# Altium schematic sheet 3_mcu_radio_0.schdoc: MCU Radio 0
size A3; DrawnBy: Sara Vega Martinez; Revision: v0.1; SheetNumber: 3; SheetTotal: 6; DesignedBy: André M. P. Mattos; ProjectRevision: v0.1
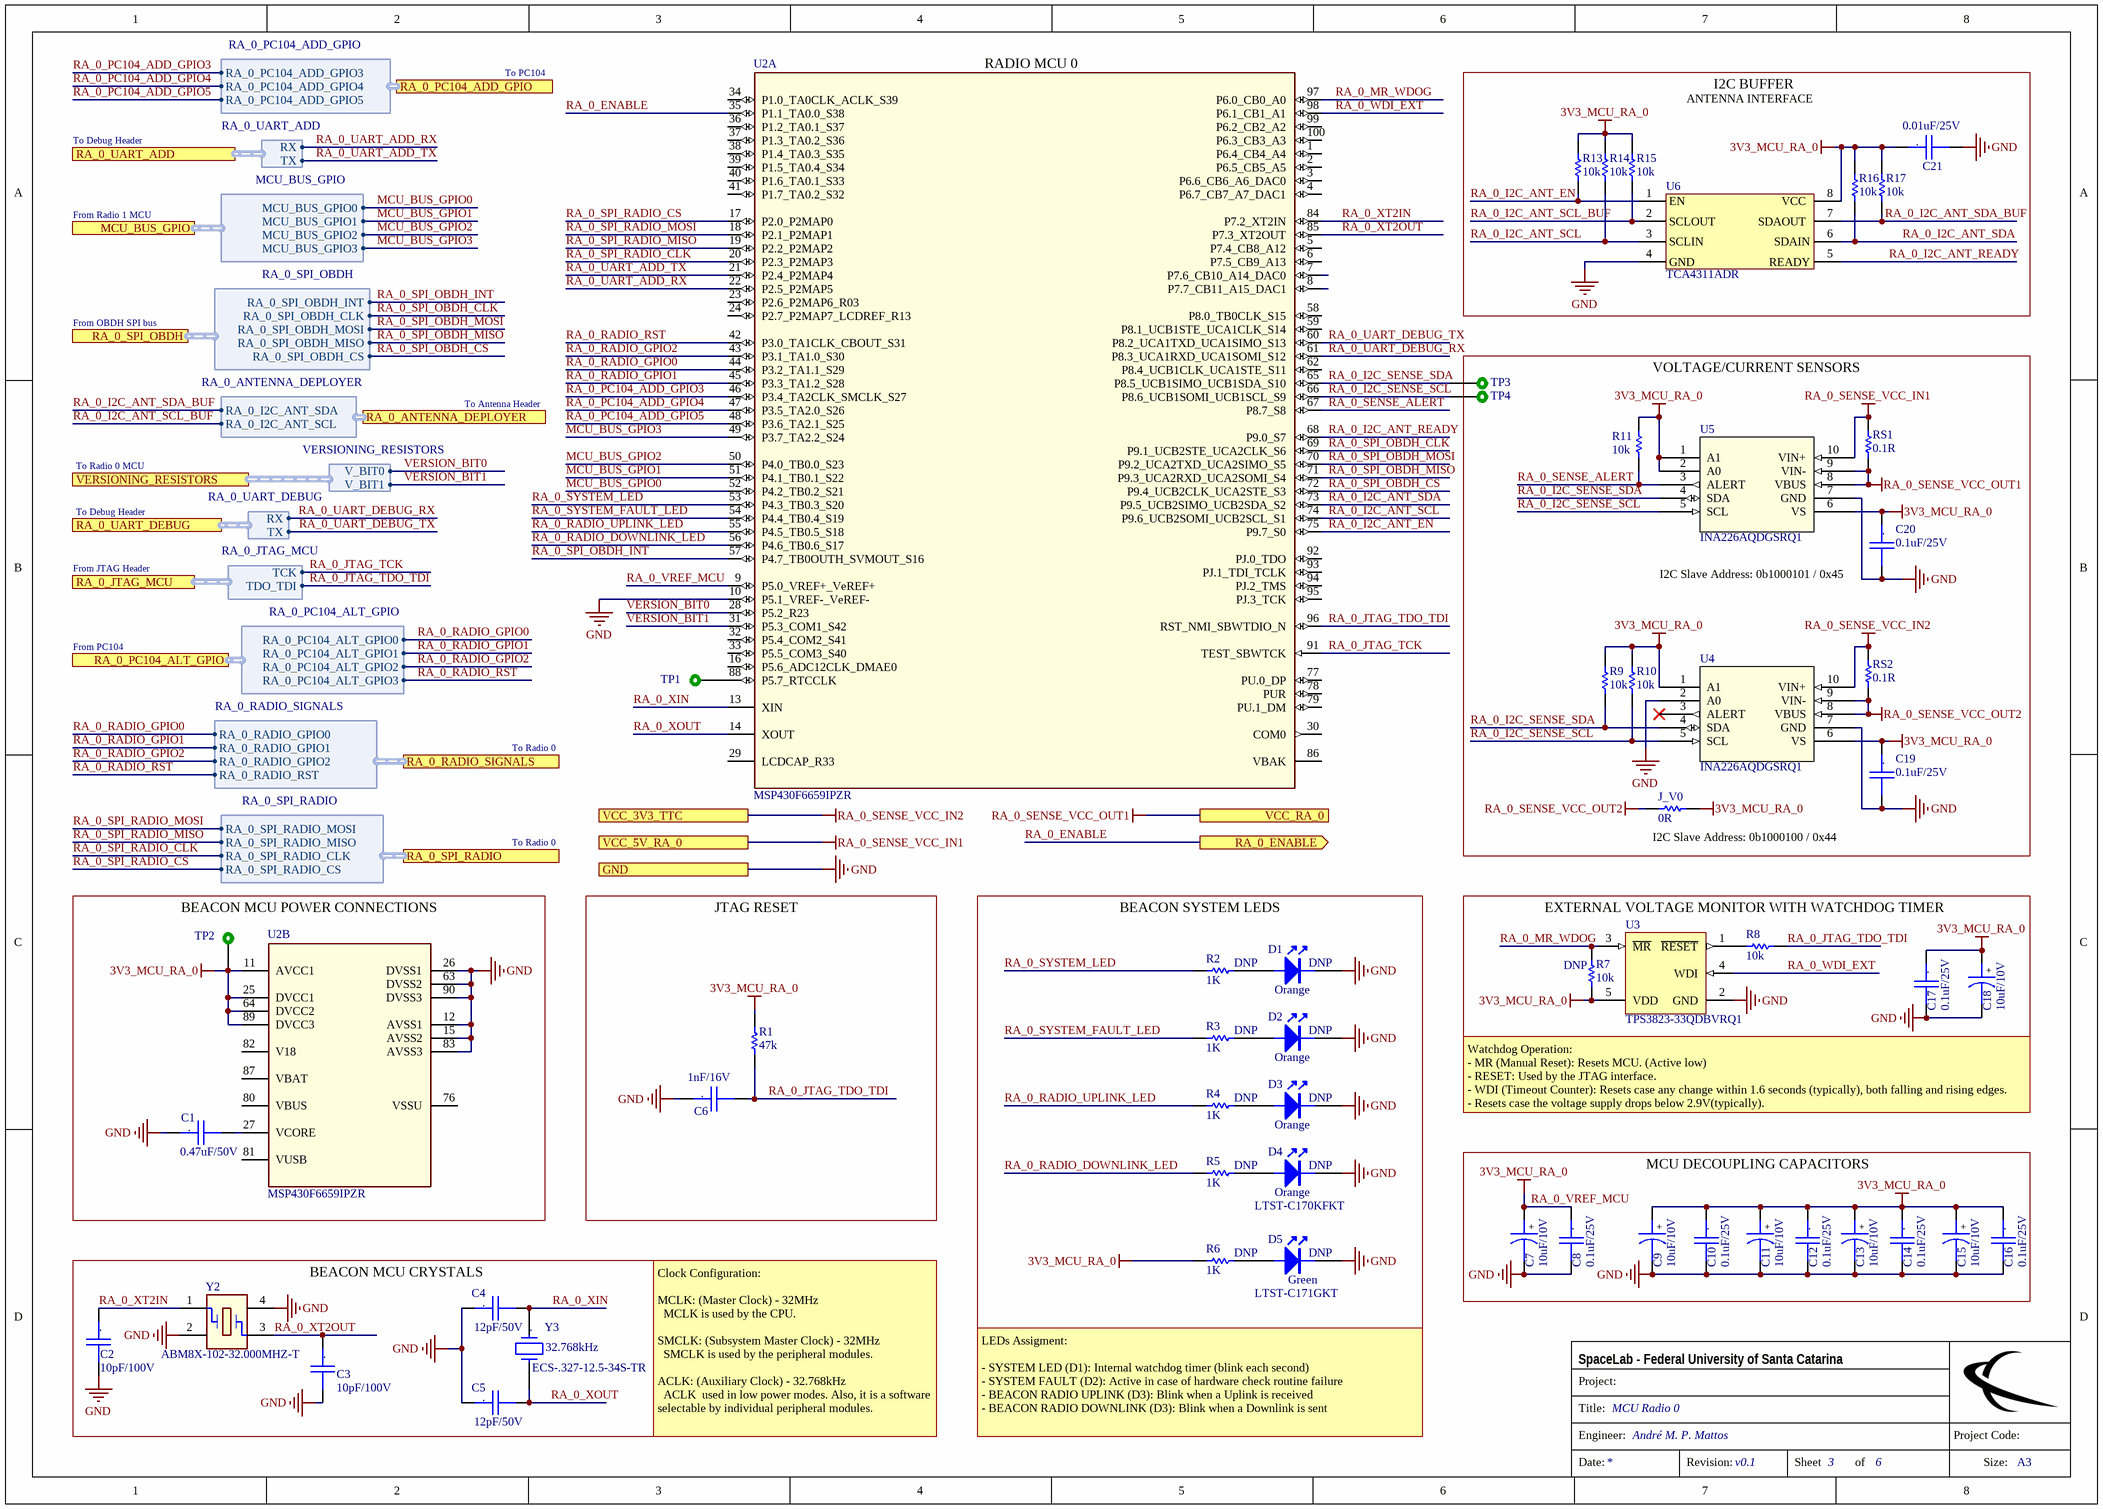
[diagram p0: 3_mcu_radio_0.schdoc]

## Parts
C1  0.47uF/50V  [CC0805]
C2  10pF/100V  [CC0805]
C3  10pF/100V  [CC0805]
C4  12pF/50V  [CC0805]
C5  12pF/50V  [CC0805]
C6  1nF/16V  [CC0603]
C7  10uF/10V  [CC0805_Tantalum]
C8  0.1uF/25V  [CC0805]
C9  10uF/10V  [CC0805_Tantalum]
C10  0.1uF/25V  [CC0805]
C11  10uF/10V  [CC0805_Tantalum]
C12  0.1uF/25V  [CC0805]
C13  10uF/10V  [CC0805_Tantalum]
C14  0.1uF/25V  [CC0805]
C15  10uF/10V  [CC0805_Tantalum]
C16  0.1uF/25V  [CC0805]
C17  0.1uF/25V  [CC0805]
C18  10uF/10V  [CC0805_Tantalum]
C19  0.1uF/25V  [CC0805]
C20  0.1uF/25V  [CC0805]
C21  0.01uF/25V  [CC0805]
D1  LTST-C170KFKT  [0805-ORANGE-LED]  (value not drawn)
D2  LTST-C170KFKT  [0805-ORANGE-LED]  (value not drawn)
D3  LTST-C170KFKT  [0805-ORANGE-LED]  (value not drawn)
D4  LTST-C170KFKT  [0805-ORANGE-LED]
D5  LTST-C171GKT  [0805-GREEN-LED]
J_V0  0R  [0805]
R1  47k  [0805]
R2  1K  [0805]
R3  1K  [0805]
R4  1K  [0805]
R5  1K  [0805]
R6  1K  [0805]
R7  10k  [0805]
R8  10k  [0805]
R9  10k  [0805]
R10  10k  [0805]
R11  10k  [0805]
R13  10k  [0805]
R14  10k  [0805]
R15  10k  [0805]
R16  10k  [0805]
R17  10k  [0805]
RS1  0.1R  [0805]
RS2  0.1R  [0805]
TP1  TEST_POINT  [TEST_POINT]  (value not drawn)  (no BOM)
TP2  TEST_POINT  [TEST_POINT]  (value not drawn)  (no BOM)
TP3  TEST_POINT  [TEST_POINT]  (value not drawn)  (no BOM)
TP4  TEST_POINT  [TEST_POINT]  (value not drawn)  (no BOM)
U2  MSP430F6659IPZR  [LQFP-100]  (parts A,B of 2)
U3  TPS3823-33QDBVRQ1  [DBV0005A_N]
U4  INA226AQDGSRQ1  [DGS10]
U5  INA226AQDGSRQ1  [DGS10]
U6  TCA4311ADR  [SOIC8]
Y2  ABM8X-102-32.000MHZ-T  [XTAL_ABM8X]
Y3  ECS-.327-12.5-34S-TR  [ABS06 0805]

## Blocks framed on the sheet
I2C BUFFER: C21 R13-R17 U6
VOLTAGE/CURRENT SENSORS: C19 C20 J_V0 R9-R11 RS1 RS2 TP3 TP4 U4 U5
BEACON MCU POWER CONNECTIONS: C1 TP2 U2
JTAG RESET: C6 R1
BEACON SYSTEM LEDS: D1-D5 R2-R6
EXTERNAL VOLTAGE MONITOR WITH WATCHDOG TIMER: C17 C18 R7 R8 U3
MCU DECOUPLING CAPACITORS: C7-C16
BEACON MCU CRYSTALS: C2-C5 Y2 Y3

## Ports
GND, MCU_BUS_GPIO (harness MCU_BUS_GPIO), RA_0_ANTENNA_DEPLOYER (harness RA_0_ANTENNA_DEPLOYER), RA_0_ENABLE (out), RA_0_JTAG_MCU (harness RA_0_JTAG_MCU), RA_0_PC104_ADD_GPIO (harness RA_0_PC104_ADD_GPIO), RA_0_PC104_ALT_GPIO (harness RA_0_PC104_ALT_GPIO), RA_0_RADIO_SIGNALS (harness RA_0_RADIO_SIGNALS), RA_0_SPI_OBDH (harness RA_0_SPI_OBDH), RA_0_SPI_RADIO (harness RA_0_SPI_RADIO), RA_0_UART_ADD (harness RA_0_UART_ADD), RA_0_UART_DEBUG (harness RA_0_UART_DEBUG), VCC_3V3_TTC, VCC_5V_RA_0, VCC_RA_0, VERSIONING_RESISTORS (harness VERSIONING_RESISTORS)

## Harnesses
RA_0_ANTENNA_DEPLOYER: RA_0_I2C_ANT_SCL, RA_0_I2C_ANT_SDA
RA_0_JTAG_MCU: TDO_TDI, TCK
RA_0_UART_DEBUG: RX, TX
RA_0_RADIO_SIGNALS: RA_0_RADIO_GPIO2, RA_0_RADIO_RST, RA_0_RADIO_GPIO0, RA_0_RADIO_GPIO1
RA_0_SPI_RADIO: RA_0_SPI_RADIO_CLK, RA_0_SPI_RADIO_MISO, RA_0_SPI_RADIO_MOSI, RA_0_SPI_RADIO_CS
RA_0_SPI_OBDH: RA_0_SPI_OBDH_CLK, RA_0_SPI_OBDH_MOSI, RA_0_SPI_OBDH_MISO, RA_0_SPI_OBDH_CS, RA_0_SPI_OBDH_INT
MCU_BUS_GPIO: MCU_BUS_GPIO0, MCU_BUS_GPIO1, MCU_BUS_GPIO2, MCU_BUS_GPIO3
RA_0_PC104_ALT_GPIO: RA_0_PC104_ALT_GPIO0, RA_0_PC104_ALT_GPIO1, RA_0_PC104_ALT_GPIO2, RA_0_PC104_ALT_GPIO3
VERSIONING_RESISTORS: V_BIT0, V_BIT1
RA_0_UART_ADD: RX, TX
RA_0_PC104_ADD_GPIO: RA_0_PC104_ADD_GPIO5, RA_0_PC104_ADD_GPIO4, RA_0_PC104_ADD_GPIO3

## Nets
GND: C1.1 C2.2 C3.2 C4.1 C5.1 C6.1 C7.2 C8.2 C9.2 C10.2 C11.2 C12.2 C13.2 C14.2 C15.2 C16.2 C17.2 C18.2 C19.2 C20.2 C21.2 D1.2(K) D2.2(K) D3.2(K) D4.2(K) D5.2(K) U2.10(P5.1_VREF-_VeREF-) U2.12(AVSS1) U2.15(AVSS2) U2.26(DVSS1) U2.63(DVSS2) U2.83(AVSS3) U2.90(DVSS3) U3.2(GND) U4.2(A0) U4.7(GND) U5.7(GND) U6.4(GND) Y2.2 Y2.4 ; port GND
RA_0_SENSE_VCC_IN1: RS1.2 U5.10(VIN+) ; port VCC_5V_RA_0
RA_0_SENSE_VCC_IN2: RS2.2 U4.10(VIN+) ; port VCC_3V3_TTC
RA_0_SENSE_VCC_OUT1: RS1.1 U5.8(VBUS) U5.9(VIN-) ; port VCC_RA_0
RA_0_SENSE_VCC_OUT2: J_V0.2 RS2.1 U4.8(VBUS) U4.9(VIN-)
RA_0_VREF_MCU: C7.1 C8.1 C9.1 C10.1 C11.1 C12.1 C13.1 C14.1 C15.1 C16.1 C17.1 C18.1 C19.1 C20.1 C21.1 J_V0.1 R1.2 R6.2 R7.1 R9.2 R10.2 R11.2 R13.2 R14.2 R15.2 R16.2 R17.2 TP2.1 U2.9(P5.0_VREF+_VeREF+) U2.11(AVCC1) U2.25(DVCC1) U2.64(DVCC2) U2.89(DVCC3) U3.5(VDD) U4.1(A1) U4.6(VS) U5.1(A1) U5.2(A0) U5.6(VS) U6.8(VCC)  [also labelled 3V3_MCU_RA_0]
MCU_BUS_GPIO0: U2.52(P4.2_TB0.2_S21) ; port MCU_BUS_GPIO.MCU_BUS_GPIO0
MCU_BUS_GPIO1: U2.51(P4.1_TB0.1_S22) ; port MCU_BUS_GPIO.MCU_BUS_GPIO1
MCU_BUS_GPIO2: U2.50(P4.0_TB0.0_S23) ; port MCU_BUS_GPIO.MCU_BUS_GPIO2
MCU_BUS_GPIO3: U2.49(P3.7_TA2.2_S24) ; port MCU_BUS_GPIO.MCU_BUS_GPIO3
RA_0_ENABLE: U2.35(P1.1_TA0.0_S38) ; port RA_0_ENABLE
RA_0_I2C_ANT_EN: R13.1 U2.75(P9.7_S0) U6.1(EN)
RA_0_I2C_ANT_READY: U2.68(P9.0_S7) U6.5(READY)
RA_0_I2C_ANT_SCL: R14.1 U2.74(P9.6_UCB2SOMI_UCB2SCL_S1) U6.3(SCLIN)
RA_0_I2C_ANT_SCL_BUF: R15.1 U6.2(SCLOUT) ; port RA_0_ANTENNA_DEPLOYER.RA_0_I2C_ANT_SCL
RA_0_I2C_ANT_SDA: R16.1 U2.73(P9.5_UCB2SIMO_UCB2SDA_S2) U6.6(SDAIN)
RA_0_I2C_ANT_SDA_BUF: R17.1 U6.7(SDAOUT) ; port RA_0_ANTENNA_DEPLOYER.RA_0_I2C_ANT_SDA
RA_0_I2C_SENSE_SCL: R10.1 TP4.1 U2.66(P8.6_UCB1SOMI_UCB1SCL_S9) U4.5(SCL) U5.5(SCL)
RA_0_I2C_SENSE_SDA: R9.1 TP3.1 U2.65(P8.5_UCB1SIMO_UCB1SDA_S10) U4.4(SDA) U5.4(SDA)
RA_0_JTAG_TCK: U2.91(TEST_SBWTCK) ; port RA_0_JTAG_MCU.TCK
RA_0_JTAG_TDO_TDI: C6.2 R1.1 R8.1 U2.96(RST_NMI_SBWTDIO_N) ; port RA_0_JTAG_MCU.TDO_TDI
RA_0_MR_WDOG: R7.2 U2.97(P6.0_CB0_A0) U3.3(~{MR})
RA_0_PC104_ADD_GPIO3: U2.46(P3.4_TA2CLK_SMCLK_S27) ; port RA_0_PC104_ADD_GPIO.RA_0_PC104_ADD_GPIO3
RA_0_PC104_ADD_GPIO4: U2.47(P3.5_TA2.0_S26) ; port RA_0_PC104_ADD_GPIO.RA_0_PC104_ADD_GPIO4
RA_0_PC104_ADD_GPIO5: U2.48(P3.6_TA2.1_S25) ; port RA_0_PC104_ADD_GPIO.RA_0_PC104_ADD_GPIO5
RA_0_RADIO_DOWNLINK_LED: R5.2 U2.56(P4.6_TB0.6_S17)
RA_0_RADIO_GPIO0: U2.44(P3.2_TA1.1_S29) ; port RA_0_RADIO_SIGNALS.RA_0_RADIO_GPIO0, port RA_0_PC104_ALT_GPIO.RA_0_PC104_ALT_GPIO0
RA_0_RADIO_GPIO1: U2.45(P3.3_TA1.2_S28) ; port RA_0_RADIO_SIGNALS.RA_0_RADIO_GPIO1, port RA_0_PC104_ALT_GPIO.RA_0_PC104_ALT_GPIO1
RA_0_RADIO_GPIO2: U2.43(P3.1_TA1.0_S30) ; port RA_0_RADIO_SIGNALS.RA_0_RADIO_GPIO2, port RA_0_PC104_ALT_GPIO.RA_0_PC104_ALT_GPIO2
RA_0_RADIO_RST: U2.42(P3.0_TA1CLK_CBOUT_S31) ; port RA_0_RADIO_SIGNALS.RA_0_RADIO_RST, port RA_0_PC104_ALT_GPIO.RA_0_PC104_ALT_GPIO3
RA_0_RADIO_UPLINK_LED: R4.2 U2.55(P4.5_TB0.5_S18)
RA_0_SENSE_ALERT: R11.1 U2.67(P8.7_S8) U5.3(ALERT)
RA_0_SPI_OBDH_CLK: U2.69(P9.1_UCB2STE_UCA2CLK_S6) ; port RA_0_SPI_OBDH.RA_0_SPI_OBDH_CLK
RA_0_SPI_OBDH_CS: U2.72(P9.4_UCB2CLK_UCA2STE_S3) ; port RA_0_SPI_OBDH.RA_0_SPI_OBDH_CS
RA_0_SPI_OBDH_INT: U2.57(P4.7_TB0OUTH_SVMOUT_S16) ; port RA_0_SPI_OBDH.RA_0_SPI_OBDH_INT
RA_0_SPI_OBDH_MISO: U2.71(P9.3_UCA2RXD_UCA2SOMI_S4) ; port RA_0_SPI_OBDH.RA_0_SPI_OBDH_MISO
RA_0_SPI_OBDH_MOSI: U2.70(P9.2_UCA2TXD_UCA2SIMO_S5) ; port RA_0_SPI_OBDH.RA_0_SPI_OBDH_MOSI
RA_0_SPI_RADIO_CLK: U2.20(P2.3_P2MAP3) ; port RA_0_SPI_RADIO.RA_0_SPI_RADIO_CLK
RA_0_SPI_RADIO_CS: U2.17(P2.0_P2MAP0) ; port RA_0_SPI_RADIO.RA_0_SPI_RADIO_CS
RA_0_SPI_RADIO_MISO: U2.19(P2.2_P2MAP2) ; port RA_0_SPI_RADIO.RA_0_SPI_RADIO_MISO
RA_0_SPI_RADIO_MOSI: U2.18(P2.1_P2MAP1) ; port RA_0_SPI_RADIO.RA_0_SPI_RADIO_MOSI
RA_0_SYSTEM_FAULT_LED: R3.2 U2.54(P4.4_TB0.4_S19)
RA_0_SYSTEM_LED: R2.2 U2.53(P4.3_TB0.3_S20)
RA_0_UART_ADD_RX: U2.22(P2.5_P2MAP5) ; port RA_0_UART_ADD.RX
RA_0_UART_ADD_TX: U2.21(P2.4_P2MAP4) ; port RA_0_UART_ADD.TX
RA_0_UART_DEBUG_RX: U2.61(P8.3_UCA1RXD_UCA1SOMI_S12) ; port RA_0_UART_DEBUG.RX
RA_0_UART_DEBUG_TX: U2.60(P8.2_UCA1TXD_UCA1SIMO_S13) ; port RA_0_UART_DEBUG.TX
RA_0_WDI_EXT: U2.98(P6.1_CB1_A1) U3.4(WDI)
RA_0_XIN: C4.2 U2.13(XIN) Y3.1
RA_0_XOUT: C5.2 U2.14(XOUT) Y3.2
RA_0_XT2IN: C2.1 U2.84(P7.2_XT2IN) Y2.1
RA_0_XT2OUT: C3.1 U2.85(P7.3_XT2OUT) Y2.3
VERSION_BIT0: U2.28(P5.2_R23) ; port VERSIONING_RESISTORS.V_BIT0
VERSION_BIT1: U2.31(P5.3_COM1_S42) ; port VERSIONING_RESISTORS.V_BIT1
NetC1_2: C1.2 U2.27(VCORE)
NetD1_1: D1.1(A) R2.1
NetD2_1: D2.1(A) R3.1
NetD3_1: D3.1(A) R4.1
NetD4_1: D4.1(A) R5.1
NetD5_1: D5.1(A) R6.1
NetR8_2: R8.2 U3.1(~{RESET})
NetTP1_1: TP1.1 U2.88(P5.7_RTCCLK)

Not connected (* = marked no-connect by the designer): U2 1(P6.4_CB4_A4) 2(P6.5_CB5_A5) 3(P6.6_CB6_A6_DAC0) 4(P6.7_CB7_A7_DAC1) 5(P7.4_CB8_A12) 6(P7.5_CB9_A13) 7(P7.6_CB10_A14_DAC0) 8(P7.7_CB11_A15_DAC1) 16(P5.6_ADC12CLK_DMAE0) 23(P2.6_P2MAP6_R03) 24(P2.7_P2MAP7_LCDREF_R13) 29(LCDCAP_R33) 30(COM0) 32(P5.4_COM2_S41) 33(P5.5_COM3_S40) 34(P1.0_TA0CLK_ACLK_S39) 36(P1.2_TA0.1_S37) 37(P1.3_TA0.2_S36) 38(P1.4_TA0.3_S35) 39(P1.5_TA0.4_S34) 40(P1.6_TA0.1_S33) 41(P1.7_TA0.2_S32) 58(P8.0_TB0CLK_S15) 59(P8.1_UCB1STE_UCA1CLK_S14) 62(P8.4_UCB1CLK_UCA1STE_S11) 76(VSSU) 77(PU.0_DP) 78(PUR) 79(PU.1_DM) 80(VBUS) 81(VUSB) 82(V18) 86(VBAK) 87(VBAT) 92(PJ.0_TDO) 93(PJ.1_TDI_TCLK) 94(PJ.2_TMS) 95(PJ.3_TCK) 99(P6.2_CB2_A2) 100(P6.3_CB3_A3); U4 3(ALERT)*

## Notes on the sheet
- To PC104
- (near U2) RADIO MCU 0
- ANTENNA INTERFACE
- To Debug Header
- From Radio 1 MCU
- From OBDH SPI bus
- To Antenna Header
- To Radio 0 MCU
- From JTAG Header
- I2C Slave Address: 0b1000101 / 0x45
- From PC104
- To Radio 0
- (near J_V0) I2C Slave Address: 0b1000100 / 0x44
- (near R2) DNP
- (near D1) DNP
- (near R7) DNP
- (near R3) DNP
- (near D2) DNP
- (near R4) DNP
- (near D3) DNP
- Watchdog Operation:
  - MR (Manual Reset): Resets MCU. (Active low)
  - RESET: Used by the JTAG interface.
  - WDI (Timeout Counter): Resets case any change within 1.6 seconds (typically), both falling and rising edges.
  - Resets case the voltage supply drops below 2.9V(typically).
- (near R5) DNP
- (near D4) DNP
- (near R6) DNP
- (near D5) DNP
- (near Y3) 32.768kHz
- Clock Configuration:
  MCLK: (Master Clock) - 32MHz
  MCLK is used by the CPU.
  SMCLK: (Subsystem Master Clock) - 32MHz
  SMCLK is used by the peripheral modules.
  ACLK: (Auxiliary Clock) - 32.768kHz
  ACLK  used in low power modes. Also, it is a software selectable by individual peripheral modules.
- LEDs Assigment:
  - SYSTEM LED (D1): Internal watchdog timer (blink each second)
  - SYSTEM FAULT (D2): Active in case of hardware check routine failure
  - BEACON RADIO UPLINK (D3): Blink when a Uplink is received
  - BEACON RADIO DOWNLINK (D3): Blink when a Downlink is sent
- Project:
- SpaceLab - Federal University of Santa Catarina
- Title:
- Engineer:
- Project Code:
- Date:
- Revision:
- Sheet
- of
- Size:
- A3
- (in symbol Cap_Cer_X7R_0.1uF_25V_0805) .
- (in symbol Cap_Cer_X7R_0.01uF_25V_0805) .
- (in symbol Cap_Cer_X7R_0.47uF_50V_0805) .
- (in symbol Cap_Cer_X7R_1nF_16V_0603) .
- (in symbol Cap_Cer_X7R_10pF_100V_0805) .
- (in symbol Cap_Cer_X7R_12pF_50V_0805) .
- (in symbol Cap_Tant_SMD_10uF_10V_0805) +
- (in symbol LED/G_0805) Green
- (in symbol LED/O_0805) Orange
- (in symbol Xtal_32.768kHz_12pF_2_SMD) .

## Library data of the parts
C1 = Cap_Cer_X7R_0.47uF_50V_0805: CAP CER 0.47UF 50V 10% X7R 0805; Partnumber: C0805C474K5RACTU; NCM: 8532.24.10
C2 C3 = Cap_Cer_X7R_10pF_100V_0805: CAP CER 10pF 100V 0805; Partnumber: 08051A100FAT2A; NCM: 8532.24.10
C4 C5 = Cap_Cer_X7R_12pF_50V_0805: CAP CER 12pF 50V 0805; Partnumber: CL21C120FBANNNC; NCM: 8532.24.10
C6 = Cap_Cer_X7R_1nF_16V_0603: CAP CER 1nF 16V 0603 5%; Partnumber: C0603X102J4RECAUTO; NCM: 8532.24.10
C7 C9 C11 C13 C15 C18 = Cap_Tant_SMD_10uF_10V_0805: CAP Tantalum 10uF 10V 20% 0805; Partnumber: TPSP106M010R2000; NCM: 8532.21.11
C8 C10 C12 C14 C16 C17 C19 C20 = Cap_Cer_X7R_0.1uF_25V_0805: CAP CER 0.1UF 25V 10% X7R 0805; Partnumber: CC0805KRX7R8BB104; NCM: 8532.24.10
C21 = Cap_Cer_X7R_0.01uF_25V_0805: CAP CER 0.01uF 25V 10% X7R 0805; Partnumber: CL21B103KAANNNC; NCM: 8532.24.10
D1-D4 = LED/O_0805: LED Orange SMD - Orange 605nm LED Indication - Discrete 2V 0805 (2012 Metric); Partnumber: LTST-C170KFKT; NCM: 8541.40.21
D5 = LED/G_0805: LED Green SMD - Green 569nm LED Indication - Discrete 2.1V 0805 (2012 Metric); NCM: 8541.40.21; Partnumber: LTST-C171GKT
J_V0 = R0R_JUMPER_1/8W_0805: RES 0R OHM 1/8W JUMPER 0805; Partnumber: CRCW08050000Z0EA; NCM: 8533.21.20
R1 = R47k_1%_1/8W_0805: RES 47k OHM 1/8W 1% 0805; Partnumber: RC0805FR-0747KL; NCM: 8533.21.20
R2-R6 = R1.0k_1%_1/8W_0805: RES 1.0K OHM 1/8W 1% 0805; Partnumber: RC0805FR-071KL; NCM: 8533.21.20
R7-R11 R13-R17 = R10k_1%_1/8W_0805: RES 10K OHM 1/8W 1%  0805; Partnumber: CRCW080510K0FKEA; NCM: 8533.21.20
RS1 RS2 = R0.1R_1%_1/3W_0805: RES 0.1R OHM 1/3W 1% 0805; Partnumber: SR732ATTER100F; NCM: 8533.21.20
TP1-TP4 = TEST_POINT: Test point
U2 = MSP430F6659IPZR: CPUXV2 series Microcontroller IC 16-Bit 20MHz 512KB (512K x 8) FLASH 100-LQFP (14x14); Manufacturer: Texas Instruments; PIN_COUNT: 100; Application_BuildNumber: *; PartNumber: MSP430F6659IPZR; Alternate PartNumber: MSP430F6659IPZ; PackageReference: PZ0100A; MountType: SMT; CompType: IC; RoHS: Y; RefDes: RefDes; Type: DEV; Value: Value
U3 = CMP-0338-00011-2: Processor Supervisory Circuit, 1 Supply Monitored, -40 to 85 degC, 5-Pin SOT-23 (DBV), Green (RoHS & no Sb/Br); Manufacturer: Texas Instruments; Iq: 15 uA Typ.; Threshold Voltage: 2.93 V Typ.; Watchdog Timer WDI: 0.2 s; VCC: 1.1 V Min.; Reset Threshold Accuracy: 2.4%; Rating: Catalog; Time Delay: 25 ms; # of Supplies Monitored: 1; Output Driver Type / Reset Output: Active-low, Push-pull; Packing: Tape and Reel; ComponentLink1Description: Manufacturer URL; RoHS: TRUE; PackageDescription: 5-Pin Plastic Small Outline, Body 1.6 x 2.9 mm, Pitch 0.95 mm; Mounting Technology: Surface Mount; ComponentLink1URL: www.ti.com; PackageReference: DBV0005A; ComponentLink3URL: http://www.ti.com/lit/ml/mpds018j/mpds018j.pdf; ComponentLink3Description: Package Specification; PartNumber: TPS3823-33QDBVRQ1; DatasheetVersion: SLVS165J; ComponentLink2Description: Datasheet; PackageVersion: 4073253-4/L; ComponentLink2URL: http://www.ti.com/lit/ds/symlink/tps3820-33.pdf; Operating Temperature Range: -40 to 85 degC
U4 U5 = INA226AQDGSRQ1: High-Side Measurement, Bi-Directional Current/Power Monitor w/I2C Interface; Manufacturer: Texas Instruments; GENERIC_PART_NUMBER: INA226; INDUSTRY_STD_PKG_TYPE: MSOP; FAMILY_NAME: CURRENT SHUNT MONITOR; PIN_COUNT: 10; PACKAGE_DESIGNATOR: DGS; Datasheet_URL: http://www.ti.com/lit/gpn/INA226; Vendor: Texas Instruments; Manufacturer_Part_Number: INA226AQDGSRQ1; Copyright: Copyright (C) 2018 Accelerated Designs. All rights reserved; RefDes: RefDes; Type: DEV; Partnumber: INA226AQDGSRQ1
U6 = TCA4311ADR: IC SIGNAL BUFFER I2C 8SOIC HOTSWAP; Partnumber: TCA4311ADR
Y2 = XTAL_32MHz_SMD_4-SMD: 32MHz ±10ppm Crystal 10pF 60 Ohm -40°C ~ 125°C; Partnumber: ABM8X-102-32.000MHZ-T; NCM: 8541.60.10
Y3 = Xtal_32.768kHz_12pF_2_SMD: 32.768kHz ±20ppm Crystal 12.5pF 70 kOhm -40°C ~ 125°C; Partnumber: ECS-.327-12.5-34S-TR; NCM: 8541.60.10